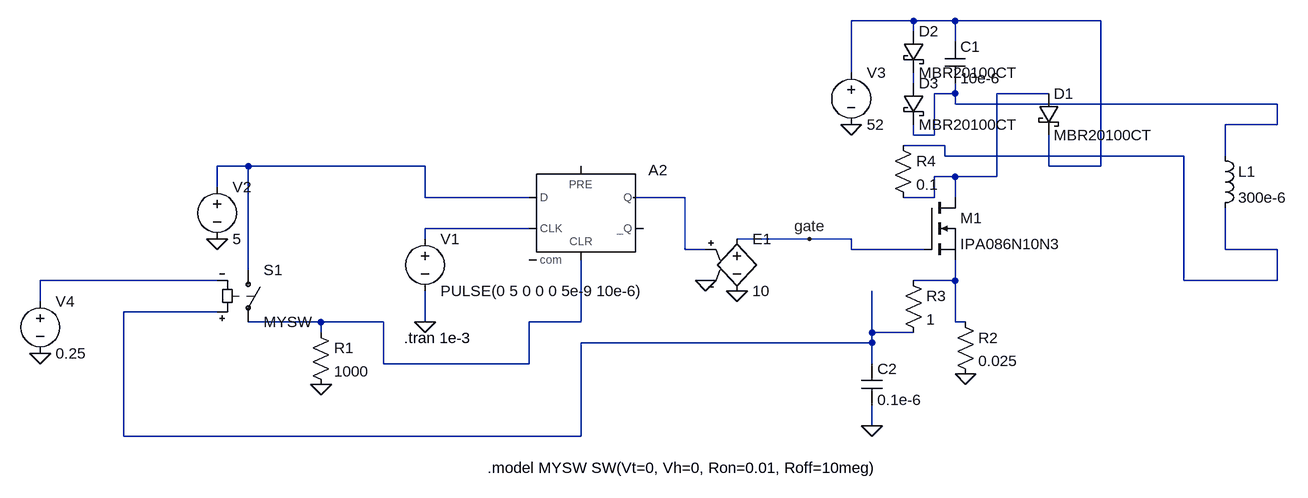
[diagram p0: schematic LT spice model hv9910c v3.asc]
LT spice model hv9910c v3.asc, the LTspice schematic file:
Version 4
SHEET 1 1096 680
WIRE 352 -128 256 -128
WIRE 416 -128 352 -128
WIRE 640 -128 416 -128
WIRE 352 -112 352 -128
WIRE 416 -96 416 -128
WIRE 256 -48 256 -128
WIRE 352 -32 352 -48
WIRE 416 -16 416 -32
WIRE 416 -16 384 -16
WIRE 560 -16 480 -16
WIRE 416 0 416 -16
WIRE 912 0 416 0
WIRE 912 32 912 0
WIRE 912 32 832 32
WIRE 352 48 352 32
WIRE 384 48 384 -16
WIRE 384 48 352 48
WIRE 400 64 336 64
WIRE 400 80 400 64
WIRE 768 80 400 80
WIRE 832 80 832 32
WIRE -672 96 -720 96
WIRE -400 96 -672 96
WIRE 560 96 560 48
WIRE 640 96 640 -128
WIRE 640 96 560 96
WIRE 416 112 384 112
WIRE 480 112 480 -16
WIRE 480 112 416 112
WIRE -720 128 -720 96
WIRE -400 144 -400 96
WIRE -240 144 -400 144
WIRE 0 144 -80 144
WIRE 384 144 384 112
WIRE 384 144 336 144
WIRE 416 144 416 112
WIRE -240 192 -400 192
WIRE -400 208 -400 192
WIRE 192 208 80 208
WIRE 256 208 192 208
WIRE 0 224 0 144
WIRE 32 224 0 224
WIRE 256 224 256 208
WIRE 368 224 256 224
WIRE 832 224 832 160
WIRE 912 224 832 224
WIRE -672 256 -672 96
WIRE -720 272 -992 272
WIRE 416 272 416 240
WIRE 416 272 352 272
WIRE 768 272 768 80
WIRE 912 272 912 224
WIRE 912 272 768 272
WIRE -992 304 -992 272
WIRE -720 320 -864 320
WIRE -560 336 -672 336
WIRE -464 336 -560 336
WIRE -400 336 -400 288
WIRE -160 336 -160 240
WIRE -160 336 -240 336
WIRE 416 336 416 272
WIRE 432 336 416 336
WIRE -560 352 -560 336
WIRE 288 352 288 288
WIRE 352 352 288 352
WIRE 288 368 288 352
WIRE 288 368 -160 368
WIRE -464 400 -464 336
WIRE -240 400 -240 336
WIRE -240 400 -464 400
WIRE 288 400 288 368
WIRE 288 496 288 464
WIRE -864 512 -864 320
WIRE -160 512 -160 368
WIRE -160 512 -864 512
FLAG -400 336 0
FLAG -720 208 0
FLAG -560 432 0
FLAG 432 416 0
FLAG 256 32 0
FLAG -992 384 0
FLAG 80 288 0
FLAG 32 272 0
FLAG 288 496 0
FLAG 192 208 gate
SYMBOL voltage -400 192 R0
WINDOW 123 0 0 Left 0
WINDOW 39 0 0 Left 0
SYMATTR InstName V1
SYMATTR Value PULSE(0 5 0 0 0 5e-9 10e-6)
SYMBOL voltage -720 112 R0
WINDOW 123 0 0 Left 0
WINDOW 39 0 0 Left 0
SYMATTR InstName V2
SYMATTR Value 5
SYMBOL sw -672 240 R0
SYMATTR InstName S1
SYMATTR Value MYSW
SYMBOL res -576 336 R0
SYMATTR InstName R1
SYMATTR Value 1000
SYMBOL nmos 368 144 R0
SYMATTR InstName M1
SYMATTR Value IPA086N10N3
SYMBOL res 416 320 R0
SYMATTR InstName R2
SYMATTR Value 0.025
SYMBOL schottky 544 -16 R0
SYMATTR InstName D1
SYMATTR Value MBR20100CT
SYMATTR Description Diode
SYMATTR Type diode
SYMBOL voltage 256 -64 R0
WINDOW 123 0 0 Left 0
WINDOW 39 0 0 Left 0
SYMATTR InstName V3
SYMATTR Value 52
SYMBOL cap 400 -96 R0
SYMATTR InstName C1
SYMATTR Value 10e-6
SYMBOL schottky 336 -112 R0
SYMATTR InstName D2
SYMATTR Value MBR20100CT
SYMATTR Description Diode
SYMATTR Type diode
SYMBOL schottky 336 -32 R0
SYMATTR InstName D3
SYMATTR Value MBR20100CT
SYMATTR Description Diode
SYMATTR Type diode
SYMBOL voltage -992 288 R0
WINDOW 123 0 0 Left 0
WINDOW 39 0 0 Left 0
SYMATTR InstName V4
SYMATTR Value 0.25
SYMBOL e 80 192 R0
SYMATTR InstName E1
SYMATTR Value 10
SYMBOL Digital\\dflop -160 96 R0
SYMATTR InstName A2
SYMBOL cap 272 400 R0
SYMATTR InstName C2
SYMATTR Value 0.1e-6
SYMBOL res 336 256 R0
SYMATTR InstName R3
SYMATTR Value 1
SYMBOL res 320 48 R0
SYMATTR InstName R4
SYMATTR Value 0.1
SYMBOL ind 816 64 R0
SYMATTR InstName L1
SYMATTR Value 300e-6
TEXT -432 360 Left 2 !.tran 1e-3
TEXT -304 560 Left 2 !.model MYSW SW(Vt=0, Vh=0, Ron=0.01, Roff=10meg)

The netlist it stands for:
* LT spice model hv9910c v3.asc
V1 N008 0 PULSE(0 5 0 0 0 5e-9 10e-6)
V2 N006 0 5
S1 N006 N012 N011 N009 MYSW
R1 N012 0 1000
M1 N004 gate N010 N010 IPA086N10N3
R2 N010 0 0.025
D1 N004 N001 MBR20100CT
V3 N001 0 52
C1 N001 N003 10e-6
D2 N001 N002 MBR20100CT
D3 N002 N003 MBR20100CT
V4 N009 0 0.25
E1 gate 0 N007 0 10
A2 N006 0 N008 0 N012 0 N007 0 DFLOP
C2 N011 0 0.1e-6
R3 N010 N011 1
R4 N005 N004 0.1
L1 N003 N005 300e-6
.model D D
.lib standard.dio
.model NMOS NMOS
.model PMOS PMOS
.lib standard.mos
.tran 1e-3
.model MYSW SW(Vt=0, Vh=0, Ron=0.01, Roff=10meg)
.backanno
.end